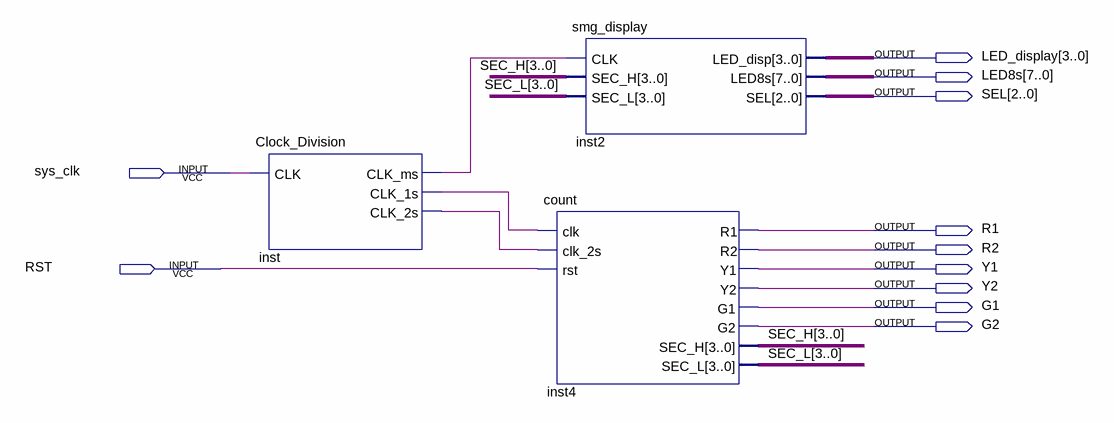
[diagram p0: schematic sheet]
// Quartus schematic traffic.bdf as structural Verilog: 3 symbols, 11 pins
module traffic (
  input  sys_clk,
  input  RST,
  output [3:0] LED_display,
  output [7:0] LED8s,
  output [2:0] SEL,
  output R1,
  output R2,
  output Y1,
  output Y2,
  output G1,
  output G2
);

  wire inst_clk_1s, inst_clk_2s, inst_clk_ms;
  wire [3:0] SEC_H, SEC_L;

  Clock_Division inst (.CLK(sys_clk), .CLK_ms(inst_clk_ms), .CLK_1s(inst_clk_1s), .CLK_2s(inst_clk_2s));
  smg_display inst2 (.CLK(inst_clk_ms), .SEC_H(SEC_H), .SEC_L(SEC_L), .LED_disp(LED_display), .LED8s(LED8s), .SEL(SEL));
  count inst4 (
    .clk(inst_clk_1s), .clk_2s(inst_clk_2s), .rst(RST), .R1(R1), .R2(R2), .Y1(Y1), .Y2(Y2), .G1(G1), .G2(G2),
    .SEC_H(SEC_H), .SEC_L(SEC_L));
endmodule
